# Altium schematic sheet leds.SchDoc
size B; Address1: MILWAUKEE TOOL; Address2: 13135 W. Lisbon Rd.; Address3: Brookfield, WI 53005; SheetNumber: 1; SheetTotal: 1
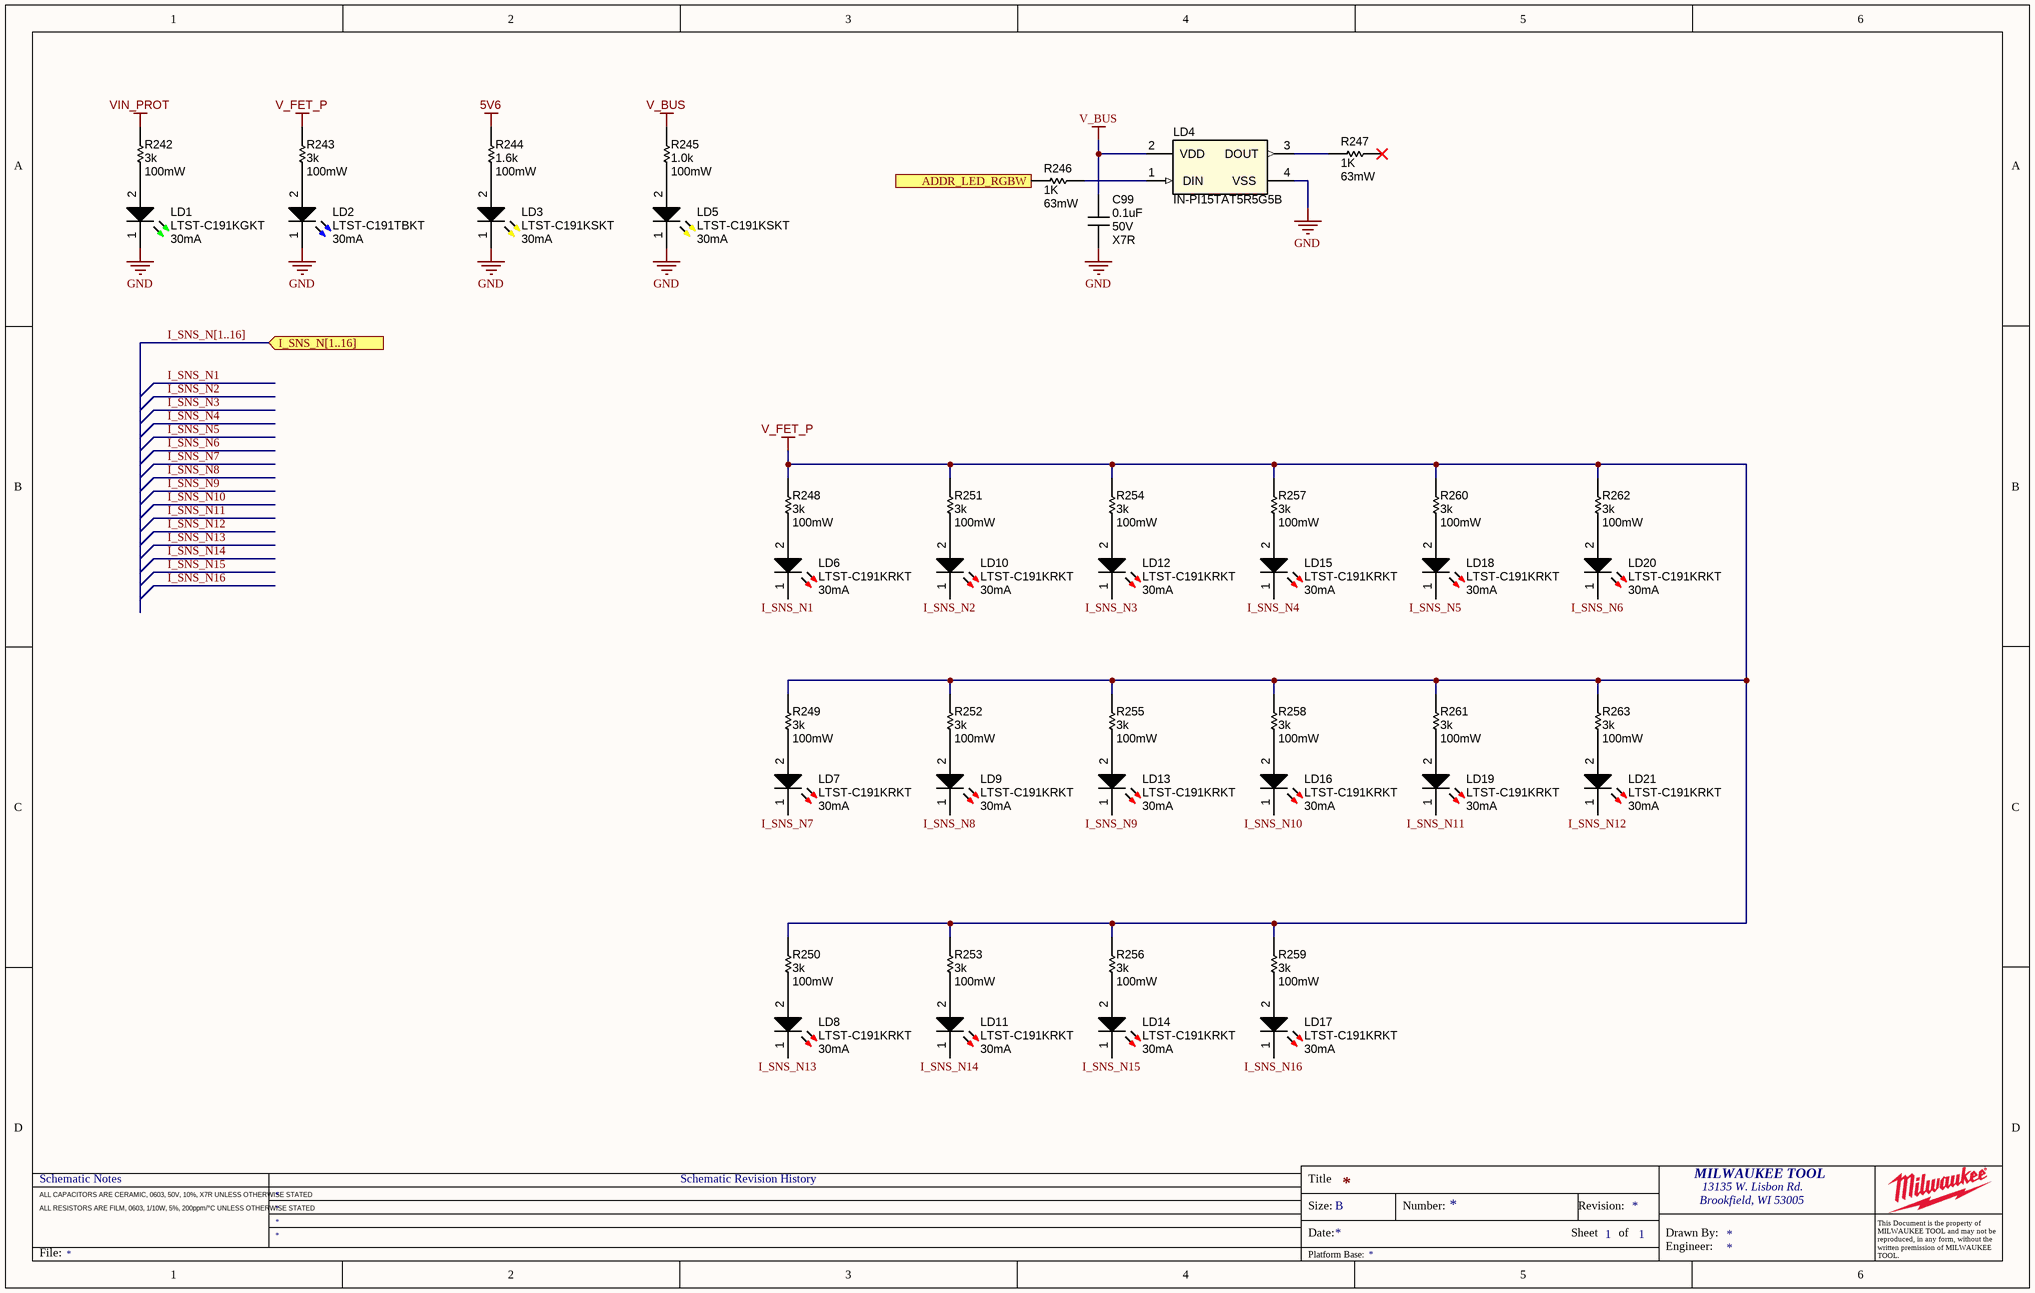
[diagram p0: leds.SchDoc]

## Parts
C99  0.1uF  Voltage Rating: 50V  Temp Coeff: X7R  [CAPC1005X06N]
LD1  LTST-C191KGKT  Current Rating: 30mA  [LED_0603_GREEN]
LD2  LTST-C191TBKT  Current Rating: 30mA  [LED_0603_BLUE]
LD3  LTST-C191KSKT  Current Rating: 30mA  [LED_0603_YELLOW]
LD4  IN-PI15TAT5R5G5B  [LED_INOLUX_IN-PI15TAT5R5G5B]
LD5  LTST-C191KSKT  Current Rating: 30mA  [LED_0603_YELLOW]
LD6  LTST-C191KRKT  Current Rating: 30mA  [LED_0603_RED]
LD7  LTST-C191KRKT  Current Rating: 30mA  [LED_0603_RED]
LD8  LTST-C191KRKT  Current Rating: 30mA  [LED_0603_RED]
LD9  LTST-C191KRKT  Current Rating: 30mA  [LED_0603_RED]
LD10  LTST-C191KRKT  Current Rating: 30mA  [LED_0603_RED]
LD11  LTST-C191KRKT  Current Rating: 30mA  [LED_0603_RED]
LD12  LTST-C191KRKT  Current Rating: 30mA  [LED_0603_RED]
LD13  LTST-C191KRKT  Current Rating: 30mA  [LED_0603_RED]
LD14  LTST-C191KRKT  Current Rating: 30mA  [LED_0603_RED]
LD15  LTST-C191KRKT  Current Rating: 30mA  [LED_0603_RED]
LD16  LTST-C191KRKT  Current Rating: 30mA  [LED_0603_RED]
LD17  LTST-C191KRKT  Current Rating: 30mA  [LED_0603_RED]
LD18  LTST-C191KRKT  Current Rating: 30mA  [LED_0603_RED]
LD19  LTST-C191KRKT  Current Rating: 30mA  [LED_0603_RED]
LD20  LTST-C191KRKT  Current Rating: 30mA  [LED_0603_RED]
LD21  LTST-C191KRKT  Current Rating: 30mA  [LED_0603_RED]
R242  3k  Wattage: 100mW  [RESC1608X06N]
R243  3k  Wattage: 100mW  [RESC1608X06N]
R244  1.6k  Wattage: 100mW  [RESC1608X06N]
R245  1.0k  Wattage: 100mW  [RESC1608X06N]
R246  1K  Wattage: 63mW  [RESC1005X04N]
R247  1K  Wattage: 63mW  [RESC1005X04N]
R248  3k  Wattage: 100mW  [RESC1608X06N]
R249  3k  Wattage: 100mW  [RESC1608X06N]
R250  3k  Wattage: 100mW  [RESC1608X06N]
R251  3k  Wattage: 100mW  [RESC1608X06N]
R252  3k  Wattage: 100mW  [RESC1608X06N]
R253  3k  Wattage: 100mW  [RESC1608X06N]
R254  3k  Wattage: 100mW  [RESC1608X06N]
R255  3k  Wattage: 100mW  [RESC1608X06N]
R256  3k  Wattage: 100mW  [RESC1608X06N]
R257  3k  Wattage: 100mW  [RESC1608X06N]
R258  3k  Wattage: 100mW  [RESC1608X06N]
R259  3k  Wattage: 100mW  [RESC1608X06N]
R260  3k  Wattage: 100mW  [RESC1608X06N]
R261  3k  Wattage: 100mW  [RESC1608X06N]
R262  3k  Wattage: 100mW  [RESC1608X06N]
R263  3k  Wattage: 100mW  [RESC1608X06N]

## Ports
ADDR_LED_RGBW (in), I_SNS_N[1..16] (in)

## Nets
5V6: R244.2
GND: C99.2 LD1.1(K) LD2.1(K) LD3.1(K) LD4.4(VSS) LD5.1(K)
V_BUS: C99.1 LD4.2(VDD) R245.2
V_FET_P: R243.2 R248.2 R249.2 R250.2 R251.2 R252.2 R253.2 R254.2 R255.2 R256.2 R257.2 R258.2 R259.2 R260.2 R261.2 R262.2 R263.2
VIN_PROT: R242.2
ADDR_LED_RGBW: R246.1 ; port ADDR_LED_RGBW
I_SNS_N1: LD6.1(K)
I_SNS_N2: LD10.1(K)
I_SNS_N3: LD12.1(K)
I_SNS_N4: LD15.1(K)
I_SNS_N5: LD18.1(K)
I_SNS_N6: LD20.1(K)
I_SNS_N7: LD7.1(K)
I_SNS_N8: LD9.1(K)
I_SNS_N9: LD13.1(K)
I_SNS_N10: LD16.1(K)
I_SNS_N11: LD19.1(K)
I_SNS_N12: LD21.1(K)
I_SNS_N13: LD8.1(K)
I_SNS_N14: LD11.1(K)
I_SNS_N15: LD14.1(K)
I_SNS_N16: LD17.1(K)
NetLD1_2: LD1.2(A) R242.1
NetLD2_2: LD2.2(A) R243.1
NetLD3_2: LD3.2(A) R244.1
NetLD4_1: LD4.1(DIN) R246.2
NetLD4_3: LD4.3(DOUT) R247.1
NetLD5_2: LD5.2(A) R245.1
NetLD6_2: LD6.2(A) R248.1
NetLD7_2: LD7.2(A) R249.1
NetLD8_2: LD8.2(A) R250.1
NetLD9_2: LD9.2(A) R252.1
NetLD10_2: LD10.2(A) R251.1
NetLD11_2: LD11.2(A) R253.1
NetLD12_2: LD12.2(A) R254.1
NetLD13_2: LD13.2(A) R255.1
NetLD14_2: LD14.2(A) R256.1
NetLD15_2: LD15.2(A) R257.1
NetLD16_2: LD16.2(A) R258.1
NetLD17_2: LD17.2(A) R259.1
NetLD18_2: LD18.2(A) R260.1
NetLD19_2: LD19.2(A) R261.1
NetLD20_2: LD20.2(A) R262.1
NetLD21_2: LD21.2(A) R263.1

Not connected (* = marked no-connect by the designer): R247 2*

## Buses and harness runs
bus I_SNS_N[1..16] = port I_SNS_N[1..16]

## Notes on the sheet
- Schematic Notes
- Schematic Revision History
- Title
- ALL CAPACITORS ARE CERAMIC, 0603, 50V, 10%, X7R UNLESS OTHERWISE STATED
- ALL RESISTORS ARE FILM, 0603, 1/10W, 5%, 200ppm/°C UNLESS OTHERWISE STATED
- Size:
- Date:
- B
- Number:
- Sheet
- Revision:
- of
- Drawn By:
- Brookfield, WI 53005
- File:
- Platform Base:
- Engineer:
- This Document is the property of MILWAUKEE TOOL and may not be reproduced, in any form, without the written premission of MILWAUKEE TOOL.

## Library data of the parts
C99 = CMP-004-0076: CAP CER SMD 0.1UF 50V X7R 0402; MFR3#: KGM05CR71H104KH; MFR#: GRM155R71H104KE14D; MFR: Murata Electronics; MFR4#: CL05B104KB54PNC; MFR2#: C1005X7R1H104K050BB; Tolerance: 10%; Populate: Yes; Temp Range: -55 / +125 C; Capacitor Type: Ceramic; Case Code (Imperial): 0402; Value: 0.1uF; MFR4: Samsung Electro-Mechanics; Design Item ID: CN/0.1uF/50V/X7R/10%/0402; Case Code (Metric): 1005; ComponentLink1URL: https://search.murata.co.jp/Ceramy/image/img/A01X/G101/ENG/GRM155R71H104KE14-01.pdf; MFR3: KYOCERA AVX; MFR2: TDK Corporation; ComponentLink1Description: Datasheet; RoHS Compliant: Yes; Part Status: Production
LD1 = CMP-012-0014: LED GREEN CLEAR 0603 SMD; MFR: Lite-On Inc.; Wavelength: 567.5 - 576.5nm; Temp Range: -55 / +85 C; Wattage: 75mW; Viewing Angle: 120°; Voltage, Forward: 1.9 - 2.5V; Voltage, Reverse: 5V; Voltage: 2V; ComponentLink1URL: https://optoelectronics.liteon.com/upload/download/DS22-2000-228/LTST-C191KGKT.PDF; Value: LTST-C191KGKT; RoHS Compliant: Yes; Colour: Green; ComponentLink1Description: Datasheet; Design Item ID: LED/GREEN/30mA/LTST-C191KGKT/Lite-On/0603; MFR#: LTST-C191KGKT; Case/Package: 0603 (1608)
LD2 = CMP-012-0016: LED BLUE CLEAR 0603 SMD; MFR: Lite-On Inc.; Wavelength: 465 - 475nm; Temp Range: -55 / +85 C; Wattage: 75mW; Viewing Angle: 120°; Voltage, Forward: 1.9 - 2.5V; Voltage, Reverse: 5V; Voltage: 2V; ComponentLink1URL: https://optoelectronics.liteon.com/upload/download/DS22-2000-230/LTST-C191TBKT.pdf; Value: LTST-C191TBKT; RoHS Compliant: Yes; Colour: Blue; ComponentLink1Description: Datasheet; Design Item ID: LED/BLUE/30mA/LTST-C191TBKT/Lite-On/0603; MFR#: LTST-C191TBKT; Case/Package: 0603 (1608)
LD3 LD5 = CMP-012-0015: LED YELLOW CLEAR 0603 SMD; MFR: Lite-On Inc.; Wavelength: 584.5 - 597nm; Temp Range: -55 / +85 C; Wattage: 75mW; Viewing Angle: 120°; Voltage, Forward: 1.9 - 2.5V; Voltage, Reverse: 5V; Voltage: 2V; ComponentLink1URL: https://optoelectronics.liteon.com/upload/download/DS22-2000-224/LTST-C191KSKT.PDF; Value: LTST-C191KSKT; RoHS Compliant: Yes; Colour: Yellow; ComponentLink1Description: Datasheet; Design Item ID: LED/YLW/30mA/LTST-C191KSKT/Lite-On/0603; MFR#: LTST-C191KSKT; Case/Package: 0603 (1608)
LD4 = CMP-012-0023: LED ADDRESSABLE RGB 1.50mm x 1.50mm; MFR: Inolux; Viewing Angle: 130 degree; Colour: RGBW; Wavelength, Red: 620-630; Current, Reverse Leakage: 10uA; Temp Range: -30 / +85 C; Voltage, Forward: 3.5V - 5.5V; Current: 12mA; Interface: Shift Register; Wavelength, Green: 515-530; Wavelength, Blue: 460-470; Wavelength, White: 4000k; Clock: 800kHz; MFR#: IN-PI15TAT5R5G5B; Part Status: Production; Value: IN-PI15TAT5R5G5B; ComponentLink1Description: Datasheet; Design Item ID: LED/RGBW/IN-PI15TAT5R5G5B; Case/Package: 1515; ComponentLink1URL: https://www.inolux-corp.com/datasheet/SMDLED/Addressable%20LED/IN-PI55QATPRPGPBPW-XX_v1.3.pdf
LD6-LD21 = CMP-012-0013: LED RED CLEAR 0603 SMD; MFR: Lite-On Inc.; Wavelength: 625nm; Temp Range: -55 / +85 C; Wattage: 75mW; Viewing Angle: 120°; Voltage, Forward: 1.9 - 2.5V; Voltage, Reverse: 5V; Voltage: 2V; ComponentLink1URL: https://optoelectronics.liteon.com/upload/download/DS22-2000-223/LTST-C191KRKT.PDF; Value: LTST-C191KRKT; RoHS Compliant: Yes; Colour: Red; ComponentLink1Description: Datasheet; Design Item ID: LED/RED/30mA/LTST-C191KRKT/Lite-On/0603; MFR#: LTST-C191KRKT; Case/Package: 0603 (1608)
R242 R243 R248-R263 = CMP-025-0012: RES SMD 3K OHM 1% 1/10W 0603; MFR: Panasonic Electronic Components; MFR#: ERJ-3EKF3001V; MFR2#: RMCF0603FT3K00; Voltage Rating: 75V; Quality: AEC-Q200; Temperature Coefficient: 100ppm/°C; Current: 1A; Value: 3k ohm; Temp Range: -55 / +155 C; MFR2: Stackpole Electronics Inc; REACH SVHC: Yes; Tolerance: 1%; RoHS Compliant: Yes; Case Code (Imperial): 0603; Resistor Type: Thick Film; Case Code (Metric): 1608; ComponentLink1URL: https://industrial.panasonic.com/cdbs/www-data/pdf/RDA0000/AOA0000C304.pdf; ComponentLink1Description: Datasheet; Design Item ID: R/3K/0.1W/1%/0603
R244 = CMP-025-0060: RES SMD 1.6K OHM 1% 1/10W 0603; MFR2#: ERJ-3EKF1601V; MFR: Stackpole Electronics Inc; MFR#: RMCF0603FT1K60; MFR3#: RK73H1JTTD1601F; Voltage Rating: 75V; Quality: AEC-Q200; Temperature Coefficient: 100ppm/°C; Temp Range: -55 / +155 C; Current: 1A; MFR2: Panasonic; Case Code (Imperial): 0603; Resistor Type: Thick Film; ComponentLink1Description: Datasheet; REACH SVHC: Yes; Case Code (Metric): 1608; Value: 1.6k ohm; RoHS Compliant: Yes; MFR3: KOA Speer Electronics; ComponentLink1URL: https://www.yageo.com/upload/media/product/productsearch/datasheet/rchip/PYu-RC_Group_51_RoHS_L_11.pdf; Tolerance: 1%; Design Item ID: R/1.6K/0.1W/1%/0603
R245 = CMP-025-0097: RES SMD 1K OHM 1% 1/10W 0603; MFR: Panasonic Electronic Components; MFR3#: RC0603FR-071KL; MFR2#: RMCF0603FT1K00; MFR4#: CRCW06031K00FKEA; MFR#: ERJ-3EKF1001V; Quality: AEC-Q200; Voltage: 75V; Current: 1A; Temp Range: -55 / +155 C; Resistor Type: Thick Film; ComponentLink1Description: Datasheet; MFR3: Yageo; Value: 1k; Part Status: Production; ComponentLink1URL: https://industrial.panasonic.com/cdbs/www-data/pdf/RDA0000/AOA0000C304.pdf; Tolerance: 1%; MFR2: Stackpole Electronics Inc; Design Item ID: R/1.0K/0.1W/1%/0603; MFR4: Vishay
R246 R247 = CMP-025-0154: RES SMD 1K OHM 1% 1/16W 0402; MFR4#: CR0402-FX-1001GLF; MFR#: RMCF0402FT1K00; MFR: Stackpole Electronics Inc; MFR3#: CRCW04021K00FKED; MFR2#: RC0402FR-071KL; Value: 1k Ohm; Voltage Rating: 75V; Temp Range: -55 / +155 C; Current: 1A; Temperature Coefficient: 100ppm/°C; Populate: Yes; MFR2: YAGEO; Tolerance: 1%; MFR3: Vishay Dale; ComponentLink1Description: Datasheet; ComponentLink1URL: https://www.yageo.com/upload/media/product/products/datasheet/rchip/PYu-RC_Group_51_RoHS_L_12.pdf; Resistor Type: Thick Film; Case Code (Imperial): 0402; MFR4: Bourns Inc; Case Code (Metric): 1005; Design Item ID: R/1.0K/0.063W/1%/0402; RoHS Compliant: Yes